# EAGLE design TSL2561 Luminosity Sensor BOB (EAGLE 6.4)
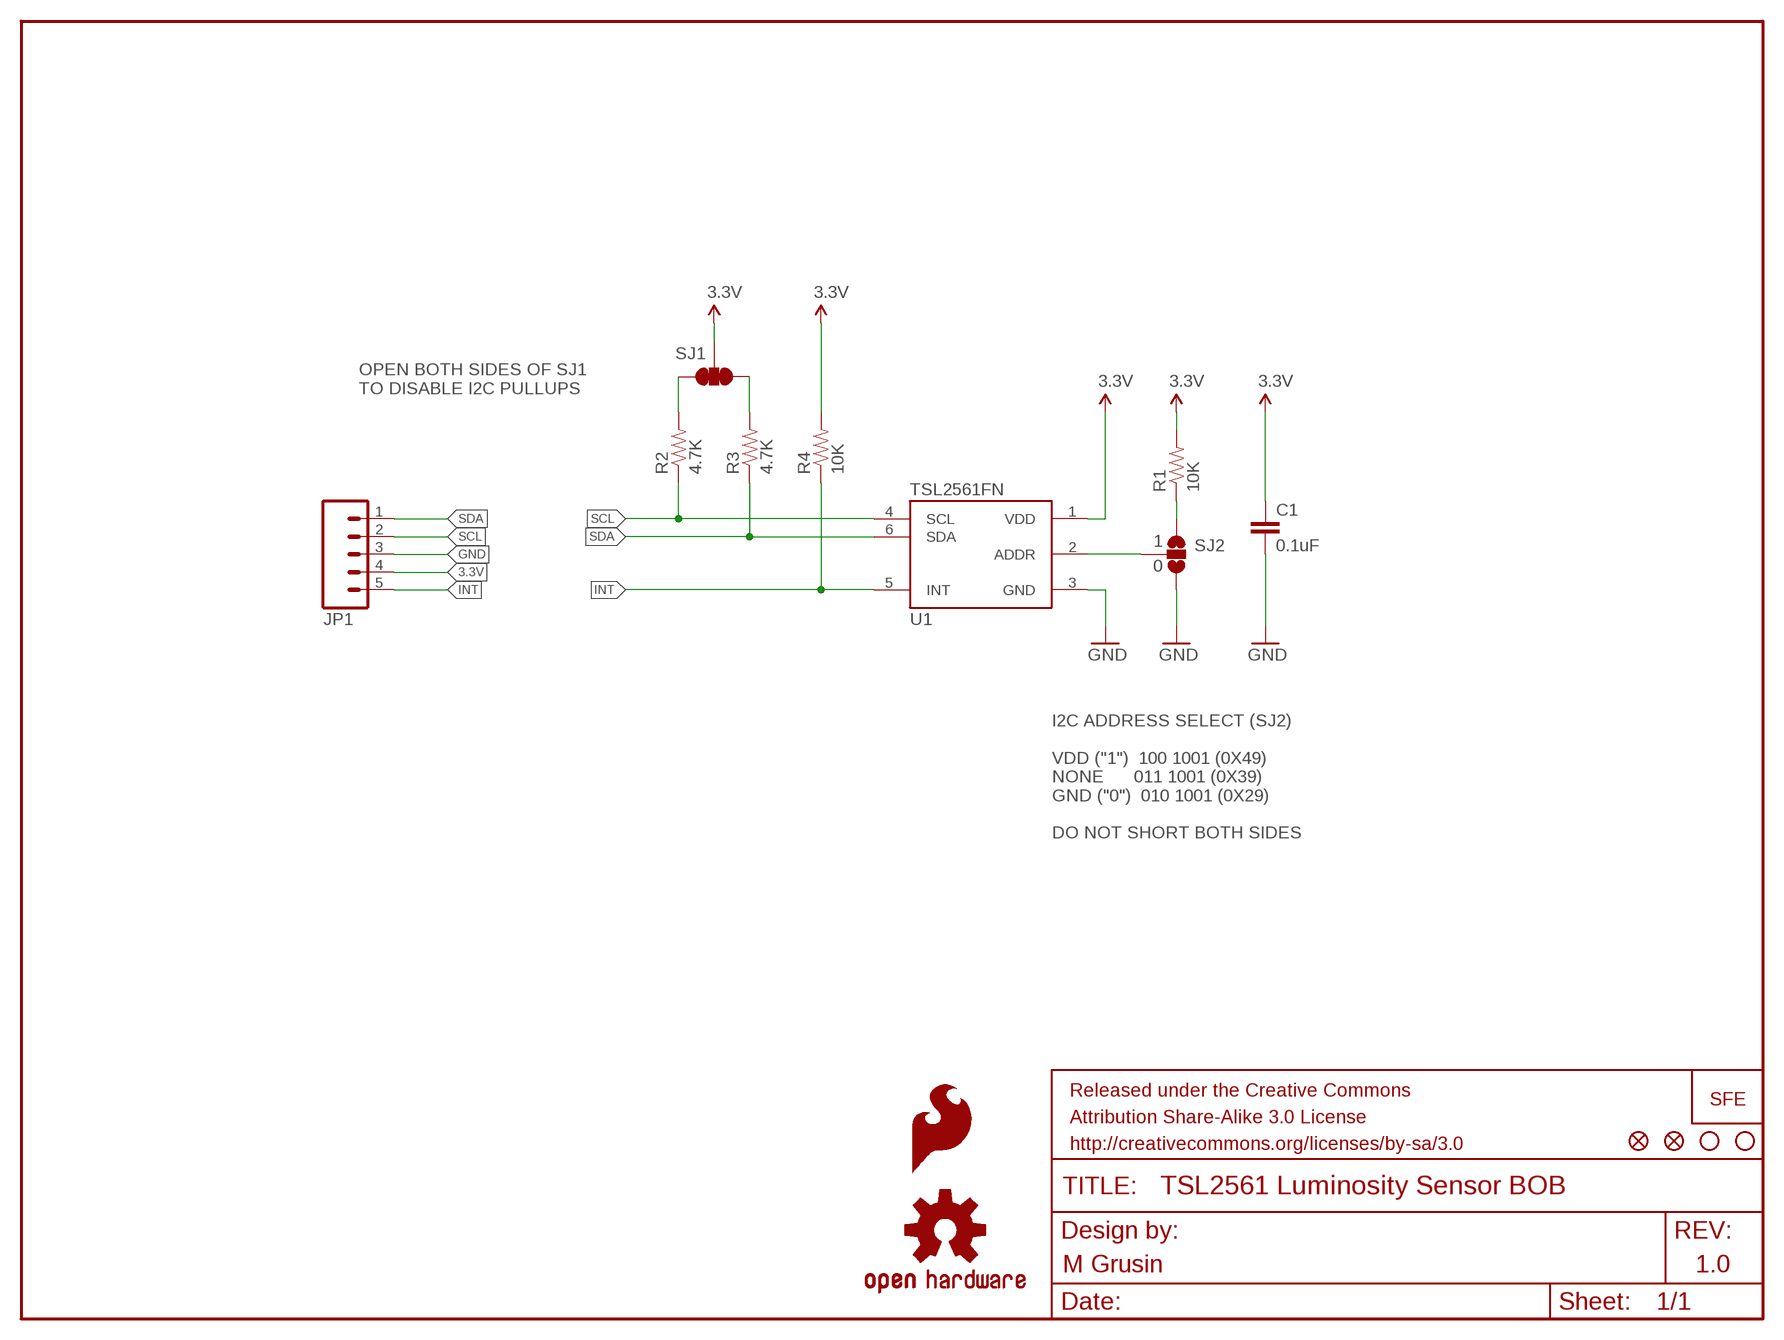
[diagram p0: schematic, sheet 1]

## Parts
C1  0.1uF  CAP0603-CAP  [0603-CAP]
FID1  FIDUCIALUFIDUCIAL  [MICRO-FIDUCIAL]
FID2  FIDUCIALUFIDUCIAL  [MICRO-FIDUCIAL]
FRAME1  FRAME-LETTER  [CREATIVE_COMMONS]
JP1  M05_ROUNDONLY_NOSILK  [1X05_ROUNDONLY_NOSILK]
LOGO1  OSHW-LOGOS  [OSHW-LOGO-S]
LOGO2  LOGO-SFENW2  [SFE-NEW-WEB]
LOGO3  SFE_LOGO_FLAME.1_INCH  [SFE_LOGO_FLAME_.1]
R1  10K  RESISTOR0603  [0603-RES]
R2  4.7K  RESISTOR0603  [0603-RES]
R3  4.7K  RESISTOR0603  [0603-RES]
R4  10K  RESISTOR0603  [0603-RES]
SJ1  SOLDERJUMPER_2WAYPASTE1&2&3  [SJ_3_PASTE1&2&3]
SJ2  SOLDERJUMPER_2WAYS  [SJ_3]
STANDOFF1  STAND-OFF  [STAND-OFF]
STANDOFF2  STAND-OFF  [STAND-OFF]
U1  TSL2561FN  [FN-6]

## Nets
3.3V: C1.1 JP1.4 R1.2 R4.2 SJ1.2 U1.1(VDD)
GND: C1.2 JP1.3 SJ2.3 U1.3(GND)
INT: JP1.5 R4.1 U1.5(INT)
N$2: R1.1 SJ2.1
N$3: SJ2.2 U1.2(ADDR)
N$8: R3.2 SJ1.1
N$9: R2.2 SJ1.3
SCL: JP1.2 R2.1 U1.4(SCL)
SDA: JP1.1 R3.1 U1.6(SDA)

## Notes on the sheet
- OPEN BOTH SIDES OF SJ1
  TO DISABLE I2C PULLUPS
- 1
- 0
- I2C ADDRESS SELECT (SJ2)
  
  VDD ("1")  100 1001 (0X49)
  NONE      011 1001 (0X39)
  GND ("0")  010 1001 (0X29)
  
  DO NOT SHORT BOTH SIDES
- M Grusin | 1.0

## Library data of the parts
C1 = SparkFun-Capacitors:CAP: Capacitor Standard 0603 ceramic capacitor, and 0.1" leaded capacitor.
FID1 FID2 = SparkFun-Aesthetics:FIDUCIAL: Fiducial Alignment Points Various fiducial points for machine vision alignment.
FRAME1 = SparkFun-Aesthetics:FRAME-LETTER: Schematic Frame Standard 8.5x11 US Letter frame
JP1 = mike-temp:M05: Header 5 Standard 5-pin 0.1" header. Use with straight break away headers (SKU : PRT-00116), right angle break away headers (PRT-00553), swiss pins (PRT-00743), machine pins (PRT-00117), and female headers (PRT-00115). Molex polarized connector foot print use with SKU : PRT-08230 with associated crimp pins and housings.
LOGO1 = SparkFun-Aesthetics:OSHW-LOGO: Open Source Hardware Logo This logo indicates the piece of hardware it is found on incorporates a OSHW license and/or adheres to the definition of open source hardware found here: http://freedomdefined.org/OSHW
LOGO2 = SparkFun-Aesthetics:LOGO-SFE: Spark Fun Electronics PCB Logo This is the standard Spark Fun Electronics PCB logo.
LOGO3 = SparkFun-Aesthetics:SFE_LOGO_FLAME: SFE Logo, flame only This is the SparkFun flame logo. The logo on the schematic will always be the same size; the package variant is the height of the flame. Default layer for the logo on the board is tSilk.
R1-R4 = SparkFun-Resistors:RESISTOR: Resistor Basic schematic elements and footprints for 0603, 1206, and PTH resistors.
SJ1 SJ2 = mike-temp:SOLDERJUMPER_2WAY: Solder Jumper 2 way solder jumper
STANDOFF1 STANDOFF2 = SparkFun-Electromechanical:STAND-OFF: #4 Stand Off This is the mechanical footprint for a #4 phillips button head screw. Use the keepout ring to avoid running the screw head into surrounding components. SKU : PRT-00447
U1 = mike-temp:TSL2561: TSL2561 illumination sensor Approximates Human Eye Response Precisely Measures Illuminance Programmable Interrupt Function with User-Defined Upper and Lower Threshold 400 KHz I2C interface Programmable Analog Gain and Integration Time Supporting 1,000,000-to-1 Dynamic Range Automatically Rejects 50/60-Hz Lighting Ripple Low Active Power (0.75 mW Typical) with Power Down Mode RoHS Compliant The TSL2561 is a light-to-digital converter that transform light intensity to a digital signal output via I2C interface. The device combines one broadband photodiode (visible plus infrared) and one infrared-responding photodiode on a single CMOS integrated circuit capable of providing a near-photopic response over an effective 20-bit dynamic range (16-bit resolution). Two integrating ADCs convert the photodiode currents to a digital output that represents the irradiance measured on each channel. This digital output can be input to a microprocessor where illuminance (ambient light level) in lux is derived using an empirical formula to approximate the human eye response. The TSL2561 device supports a traditional level style interrupt that remains asserted until the firmware clears it.

## Board
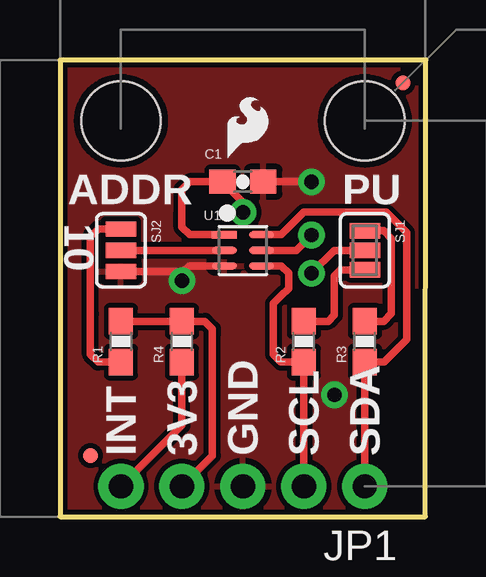
[diagram p1: board, top side]
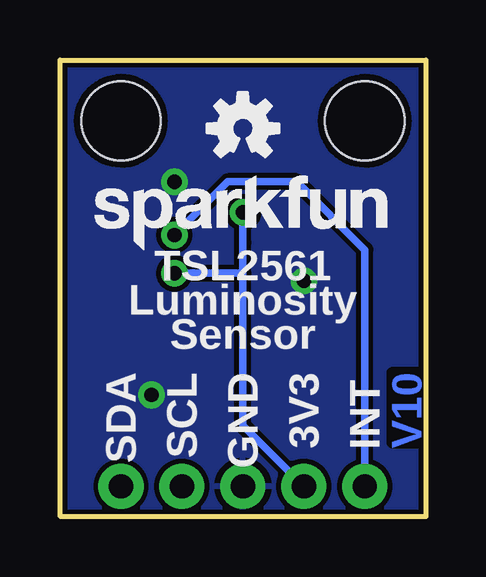
[diagram p2: board, bottom side, seen from below]

Size 15.24 x 19.05 mm. Coordinates in mm from the lower left corner, seen from the top.
Outline: 0,0 15.22,0 15.24,19.05 0,19.05 0,0
Copper layers (1*16): Top 0.035mm / dielectric 1.5mm / Bottom 0.035mm
Design rules "SparkFun": minimum track width 7mil, minimum drill 15mil, track to track 8mil, track to pad 8mil, pad to pad 8mil, via to via 8mil, smd to smd 8mil, copper to edge 8mil, drill to drill 8mil, minimum pad ring 12mil, minimum via ring 10mil, stop-mask expansion 4mil, vias tented up to drill 20mil, thermal gap 10mil

### Footprints (pad centres in the part's own frame; a part is rotated, then mirrored left to right if it is on the bottom)
0603-CAP = smd 1.1 x 1: 1 -0.85,0; 2 0.85,0
MICRO-FIDUCIAL = smd 0.635 x 0.635: 1 0,0
1X05_ROUNDONLY_NOSILK = drill 1.016 pad 1.88: 1 0,0; 2 2.54,0; 3 5.08,0; 4 7.62,0; 5 10.16,0
0603-RES = smd 1.1 x 1: 1 -0.85,0; 2 0.85,0
SJ_3_PASTE1&2&3 = smd 0.635 x 1.27: 1 -0.813,0; 2 0,0; 3 0.813,0
SJ_3 = smd 0.635 x 1.27: 1 -0.889,0; 2 0,0; 3 0.889,0
STAND-OFF = hole 3.302: 0,0
FN-6 = smd 1.05 x 0.3: 1 -0.775,0.65; 2 -0.775,0; 3 -0.775,-0.65; 4 0.775,-0.65; 5 0.775,0; 6 0.775,0.65

### Placement (x,y rotation side)
C1  7.62,13.97 0 top
FID1  1.27,2.54 0 top
FID2  14.29,18.1 0 top
FRAME1  -22.86,-10.16 0 top  (outside the outline)
JP1  12.7,1.27 180 top
LOGO1  7.62,16.19 0 bottom
LOGO2  13.81,11.11 0 bottom
LOGO3  6.67,14.61 0 top
R1  2.54,7.3 90 top
R2  10.16,7.3 90 top
R3  12.7,7.3 90 top
R4  5.08,7.3 90 top
SJ1  12.7,11.11 270 top
SJ2  2.54,11.11 270 top
STANDOFF1  2.54,16.51 0 top
STANDOFF2  12.7,16.51 0 top
U1  7.62,11.11 0 top

### Tracks (layer width: path | path; a pad name or v marks a point on that pad's centre or on a via)
3.3V  (via drill 0.6)
  Top 0.305: U1.1 5.4,11.76 5.08,12.08 5.08,12.7 5.08,13.65 5.4,13.97 C1.1 7.62,13.12 v7.62,12.7 | JP1.4 6.35,2.54 6.35,7.62 6.35,7.83 6.03,8.15 R4.2 R1.2 | SJ1.2 11.43,11.11 v10.48,10.16
  Bottom 0.305: v10.48,10.16 7.62,10.16 | 7.62,10.16 7.62,11.43 v7.62,12.7 | JP1.4 7.62,3.81 7.62,10.16
GND  (via drill 0.6)
  Top 0.305: U1.3 5.38,10.46 5.14,10.22 SJ2.3 2.54,10.16 | C1.2 v10.48,13.97
  other vias: 5.08,9.84 11.43,5.08
  pour Top: 0,19.05 15.24,19.05 15.24,0 0,0
  pour Bottom: 0,19.05 15.24,19.05 15.24,0 0,0
INT  (via drill 0.6)
  Top 0.305: JP1.5 5.08,3.81 R4.1 | U1.5 9.84,11.11 v10.48,11.75
  Bottom 0.305: JP1.5 2.54,11.13 5.38,13.97 8.26,13.97 v10.48,11.75
N$2
  Top 0.305: SJ2.1 1.59,12 1.27,11.68 1.27,8.47 1.27,6.77 1.59,6.45 R1.1
N$3
  Top 0.305: U1.2 SJ2.2
N$8
  Top 0.305: R3.2 13.49,8.15 13.81,8.47 13.81,11.61 13.49,11.93 SJ1.1
N$9
  Top 0.305: R2.2 11.18,8.15 11.43,8.41 11.43,10.05 11.68,10.3 SJ1.3
SCL
  Top 0.305: JP1.2 R2.1 9.21,6.45 8.89,6.77 8.89,8.89 9.21,9.21 9.53,9.53 9.53,10.16 9.22,10.46 U1.4
SDA
  Top 0.305: JP1.1 R3.1 13.51,6.45 14.45,7.39 14.45,11.84 13.59,12.7 10.16,12.7 9.22,11.76 U1.6

### Text on the board
Bottom: V10
tPlace: ADDR | PU | 10 | INT | 3V3 | GND | SCL | SDA
bPlace: TSL2561 | Luminosity | Sensor | INT | 3V3 | GND | SCL | SDA
tValues: M Grusin
tDocu: 0.125 x 2